# EAGLE design BaseBoard (EAGLE 8.5.0)
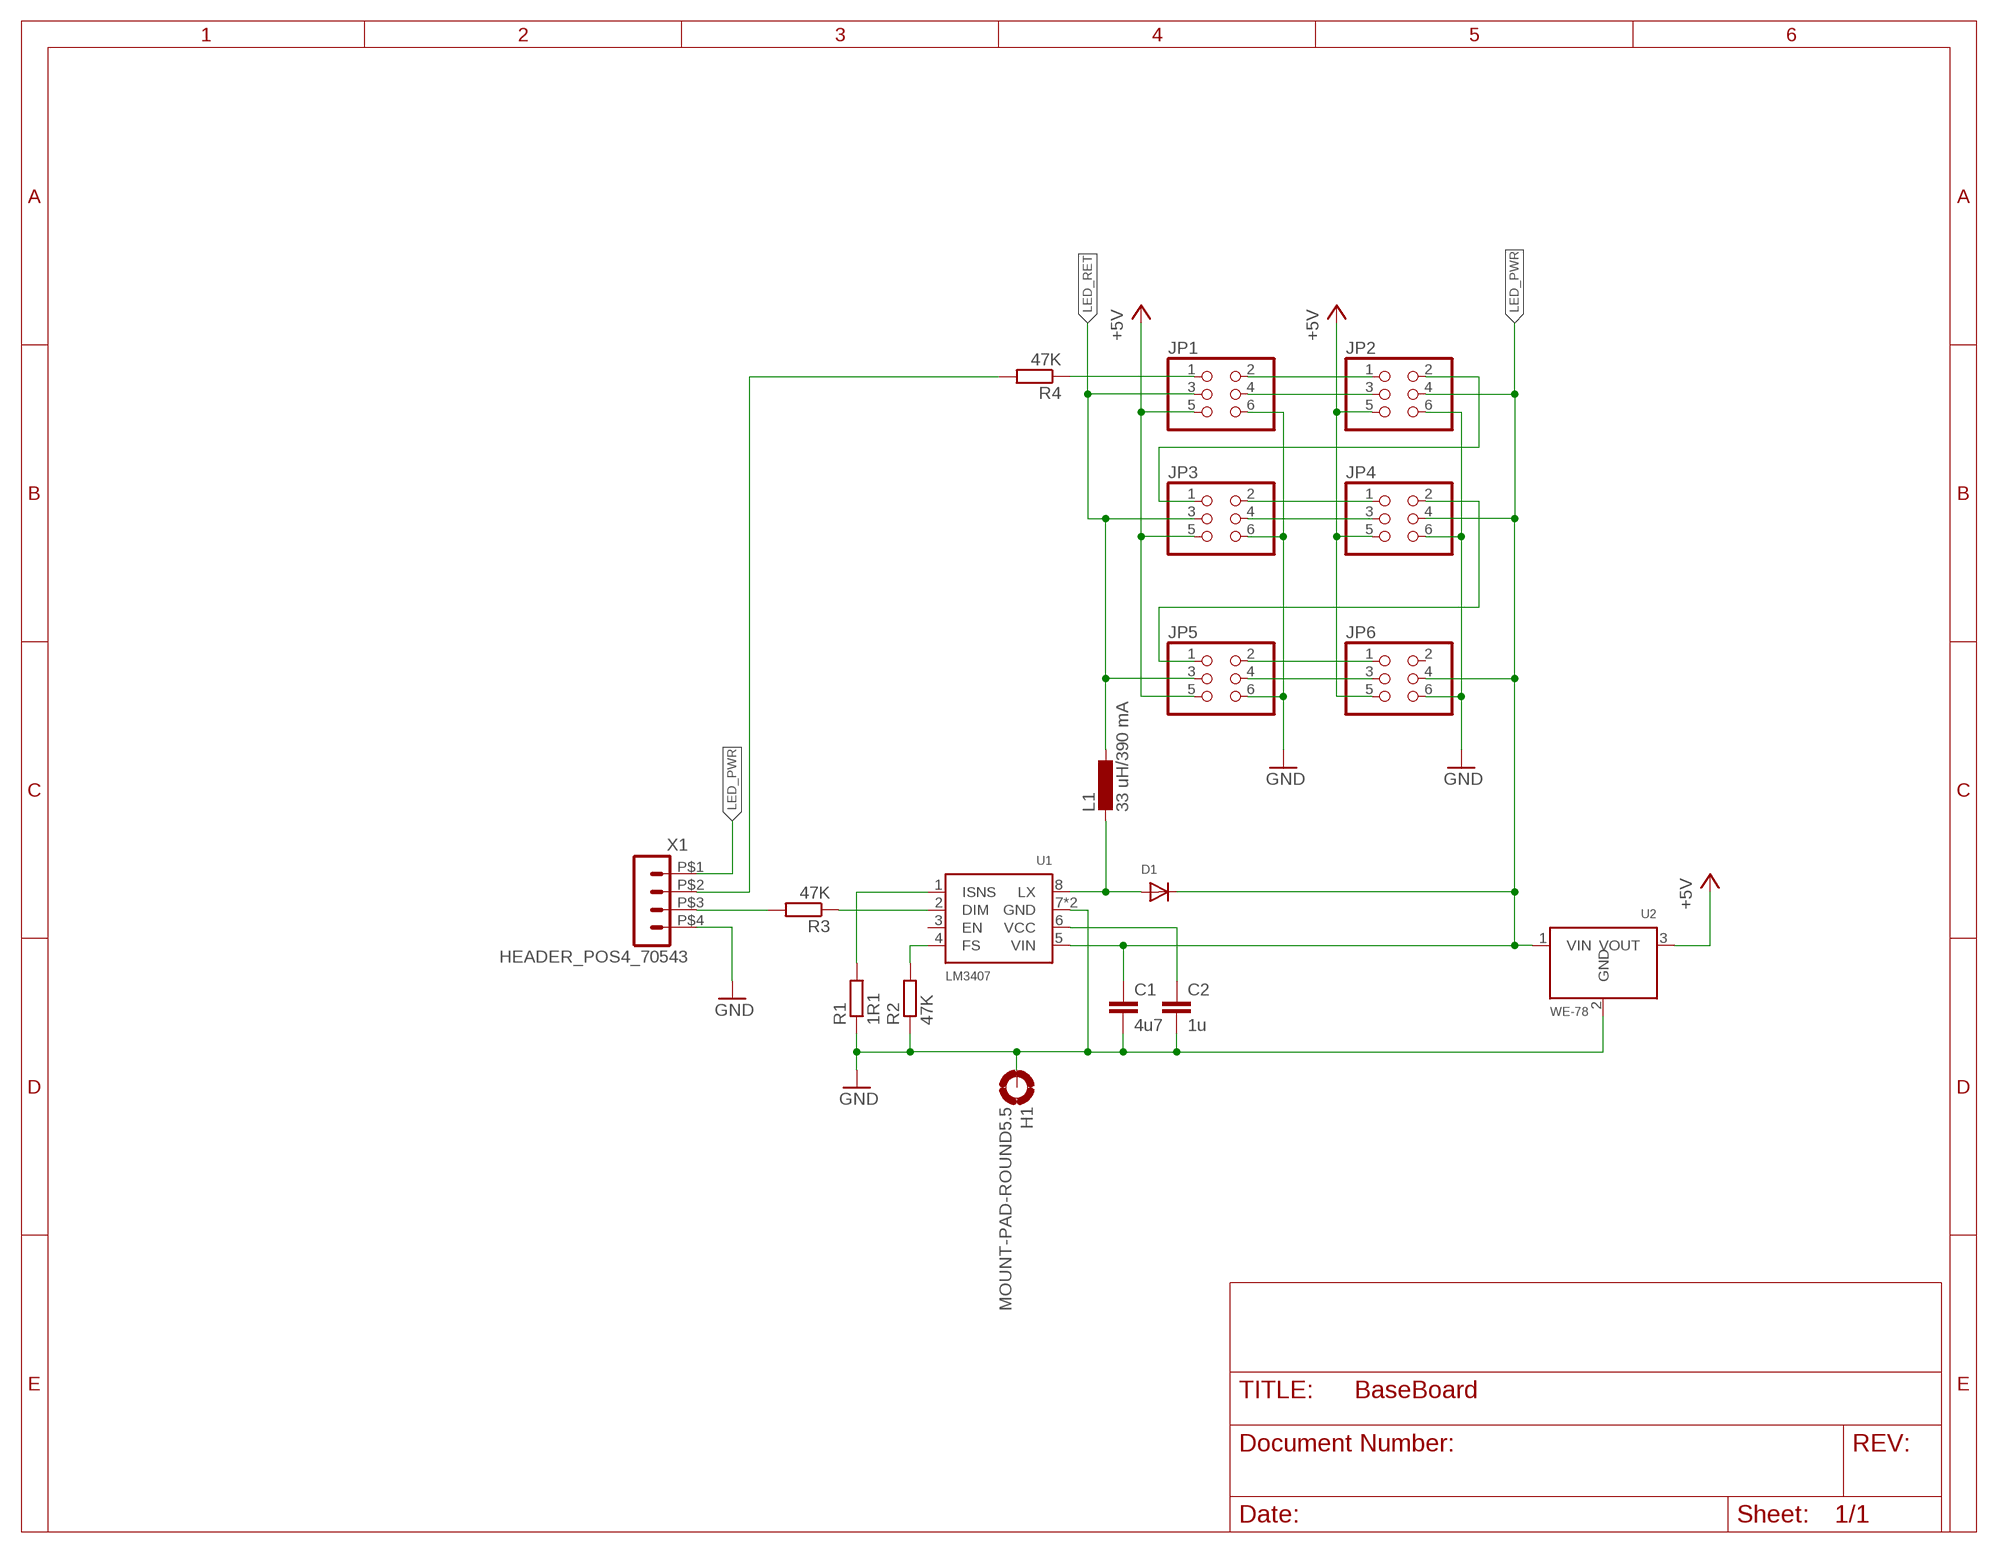
[diagram p0: schematic, sheet 1]

## Parts
C1  4u7  C-EUC1206  [C1206]
C2  1u  C-EUC0603  [C0603]
D1  DIODESOD-123  [SOD-123]
H1  MOUNT-PAD-ROUND5.5  [5,5-PAD]
JP1  PINHD-2X3  [2X03]
JP2  PINHD-2X3  [2X03]
JP3  PINHD-2X3  [2X03]
JP4  PINHD-2X3  [2X03]
JP5  PINHD-2X3  [2X03]
JP6  PINHD-2X3  [2X03]
L1  33 uH/390 mA  INDUCTOR-LQH32N  [C1210]
R1  1R1  R-EU_R1206  [R1206]
R2  47K  R-EU_R0603  [R0603]
R3  47K  R-EU_R0603  [R0603]
R4  47K  R-EU_R0603  [R0603]
U1  LM3407  [MSOP8-GND]
U2  WE-78  [WE-78]
X1  HEADER_POS4_70543  [70543-POS4]

## Nets
+5V: JP1.5 JP2.5 JP3.5 JP4.5 JP5.5 JP6.5 U2.3(VOUT)
GND: C1.2 C2.2 H1.B5,5(MOUNT) JP1.6 JP2.6 JP3.6 JP4.6 JP5.6 JP6.6 R1.1 R2.1 U1.7(GND) U1.THERM(GND) U2.2(GND) X1.P$4
LED_PWR: C1.1 D1.C JP2.4 JP4.4 JP6.4 U1.5(VIN) U2.1(VIN) X1.P$1
LED_RET: JP1.3 JP3.3 JP5.3 L1.1
N$1: R1.2 U1.1(ISNS)
N$2: R2.2 U1.4(FS)
N$3: R3.1 U1.2(DIM)
N$4: D1.A L1.2 U1.8(LX)
N$5: JP1.4 JP2.3
N$6: C2.1 U1.6(VCC)
N$7: JP3.4 JP4.3
N$8: JP5.4 JP6.3
N$9: JP1.2 JP2.1
N$10: JP2.2 JP3.1
N$11: JP4.2 JP5.1
N$12: JP5.2 JP6.1
N$13: JP3.2 JP4.1
N$14: R3.2 X1.P$3
N$15: R4.2 X1.P$2
N$19: JP1.1 R4.1
Unconnected: JP6.2 U1.3(EN)

## Library data of the parts
C1 C2 = resistor:C-EU: CAPACITOR, European symbol
D1 = adafruit:DIODE: Diode SMADIODE - SMA Surface Mount Package 20V 1A Schottky Diode Digikey: 641-1014-6-ND DO-1N4148 - Through Hole Small Current Diode SOD-123 20V 1 A (.5mV Vf) Schottky Diode - Digikey: MBRX120TPMSCT-ND SOD-323 10V 570mA (.38mV Vf, 3ns) Schottky Diode - Digikey: ZLLS410CT-ND SOD-523 30V 30mA Schottky Diode (RB751S-40TE61) - Digikey: RB751S-40TE61CT-ND SOT23-R/W - SOT23 Package (R = Solder Paste/Reflow Ovens, W = Hand-Soldering) BAT54Film 40V 300mA - Digikey: 497-7162-1-ND
H1 = holes:MOUNT-PAD-ROUND: MOUNTING PAD, round
JP1-JP6 = pinhead:PINHD-2X3: PIN HEADER
L1 = PowerComponents:INDUCTOR
R1-R4 = resistor:R-EU_: RESISTOR, European symbol
U1 = PowerComponents:LM3407
U2 = PowerComponents:WE-78
X1 = con-molex-c-grid-sl:HEADER_POS4_?: Molex -C-Grid® / SL Series connector Wire-to-Board 2.54 mm (0.100") pitch header, 4 positions.

## Board
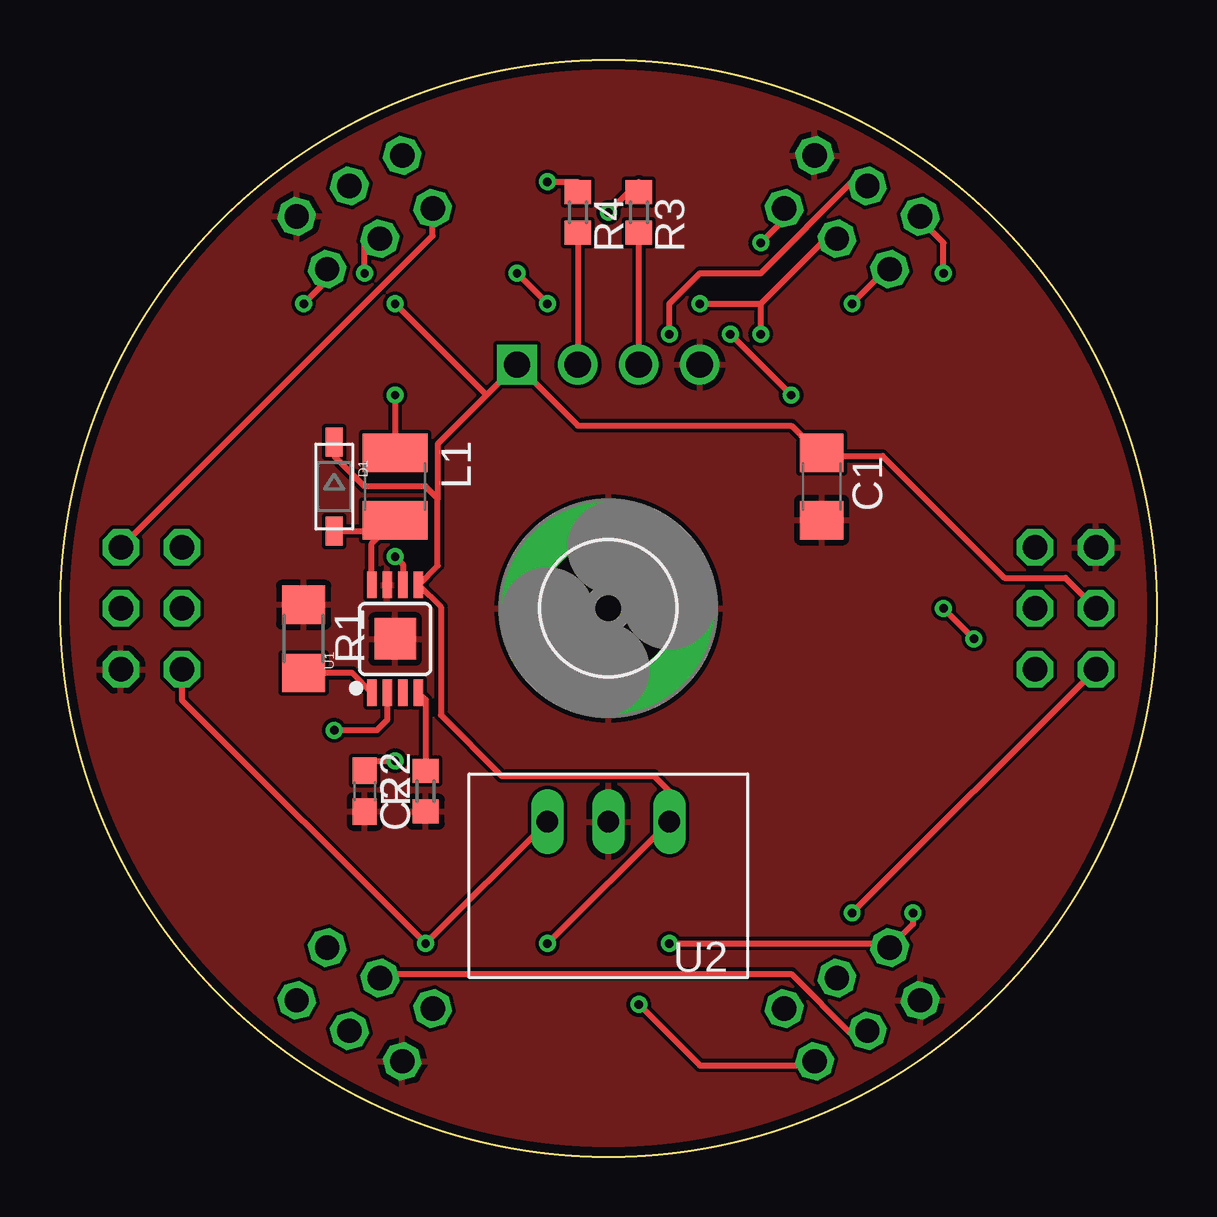
[diagram p1: board, top side]
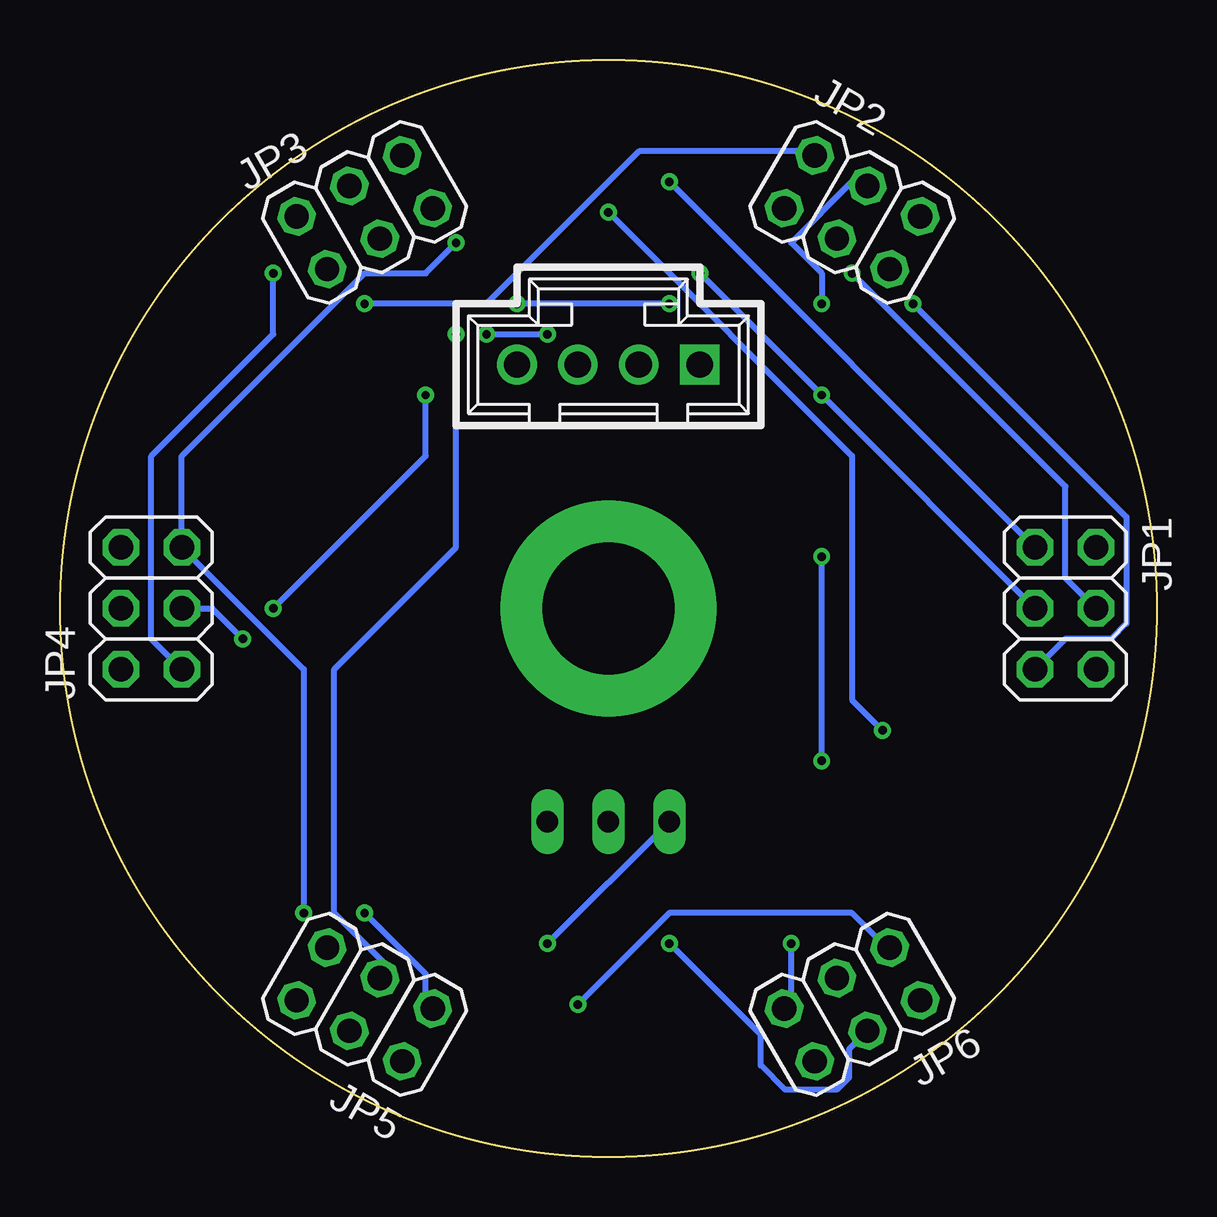
[diagram p2: board, bottom side, seen from below]

Size 45.72 x 45.72 mm. Coordinates in mm from the lower left corner, seen from the top.
Outline: circle at 22.86,22.86 radius 22.86
Copper layers (1*16): Top 0.0356mm / dielectric 1.5011mm / Bottom 0.0356mm
Design rules "LaenPCBOrder": minimum track width 6mil, minimum drill 13mil, track to track 6mil, track to pad 6mil, pad to pad 6mil, via to via 6mil, smd to smd 6mil, copper to edge 15mil, drill to drill 6mil, minimum pad ring 7mil, minimum via ring 7mil, stop-mask expansion 4mil, vias tented up to drill 0mil, thermal gap 10mil

### Footprints (pad centres in the part's own frame; a part is rotated, then mirrored left to right if it is on the bottom)
C1206 = smd 1.6 x 1.8: 1 -1.4,0; 2 1.4,0
C0603 = smd 1.1 x 1: 1 -0.85,0; 2 0.85,0
SOD-123 = smd 1.2 x 0.7: A 1.85,0; C -1.85,0
5,5-PAD = drill 5.5 pad 9: B5,5 0,0
2X03 = drill 1.016 octagon: 1 -2.54,-1.27; 2 -2.54,1.27; 3 0,-1.27; 4 0,1.27; 5 2.54,-1.27; 6 2.54,1.27
C1210 = smd 1.6 x 2.7: 1 -1.4,0; 2 1.4,0
R1206 = smd 1.6 x 1.803: 1 -1.422,0; 2 1.422,0
R0603 = smd 1 x 1.1: 1 -0.85,0; 2 0.85,0
MSOP8-GND = smd 0.4 x 1.1: 1 -0.975,-2.25; 2 -0.325,-2.25; 3 0.325,-2.25; 4 0.975,-2.25; 5 0.975,2.25; 6 0.325,2.25; 7 -0.325,2.25; 8 -0.975,2.25 | smd 1.727 x 1.727: THERM 0,0
WE-78 = drill 0.9 long: 1 -2.54,0; 2 0,0; 3 2.54,0
70543-POS4 = drill 1.1 square: P$1 3.81,0 | drill 1.1: P$2 1.27,0; P$3 -1.27,0; P$4 -3.81,0

### Placement (x,y rotation side)
C1  31.75,27.94 270 top
C2  12.7,15.24 270 top
D1  11.43,27.94 270 top
H1  22.86,22.86 0 top
JP1  3.81,22.86 270 bottom
JP2  12.7,39.37 330 bottom
JP3  33.02,39.37 30 bottom
JP4  41.91,22.86 90 bottom
JP5  33.02,6.35 150 bottom
JP6  12.7,6.35 210 bottom
L1  13.97,27.94 270 top
R1  10.16,21.59 270 top
R2  15.24,15.24 90 top
R3  24.13,39.37 270 top
R4  21.59,39.37 270 top
U1  13.97,21.59 0 top
U2  22.86,13.97 180 top
X1  22.86,33.02 0 bottom

### Tracks (layer width: path | path; a pad name or v marks a point on that pad's centre or on a via)
+5V  (via drill 0.35)
  Top 0.254: U2.3 v15.24,8.89 5.08,19.05 JP1.5 | v25.4,8.89 34.29,8.89 JP5.5 35.56,9.7 v35.56,10.16 | v10.16,35.56 11.43,36.83 JP2.5 | v29.21,38.1 30.48,39.37 JP3.5
  Bottom 0.254: v15.24,8.89 15.24,6.35 JP6.5 | U2.3 v25.4,8.89 | v35.56,10.16 35.56,20.32 JP4.5 40.64,29.21 33.02,36.83 30.48,36.83 v29.21,38.1 | v10.16,35.56 1.27,26.67 1.27,22.23 1.91,21.59 3.81,21.59 JP1.5
GND
  pour Top: 0,0 0,45.72 45.72,45.72 45.72,0
LED_PWR  (via drill 0.35)
  Top 0.254: D1.C 11.43,29.21 12.7,27.94 15.24,27.94 15.75,27.43 | 15.75,27.43 15.75,24.64 U1.5 15.88,22.91 15.88,18.41 18.41,15.88 24.77,15.88 25.4,15.24 U2.1 v20.32,8.89 | 17.78,31.75 X1.P$1 21.59,30.48 30.48,30.48 31.75,29.21 | 17.78,31.75 15.75,29.72 15.75,27.43 | JP4.4 41.91,24.13 39.37,24.13 34.29,29.21 31.75,29.21 | 31.75,29.21 C1.1 | v13.97,35.56 17.78,31.75
  Bottom 0.254: v20.32,8.89 16.51,5.08 16.51,3.81 15.49,2.79 13.34,2.79 12.83,3.3 12.83,4.49 JP6.4 | v13.97,35.56 13.97,36.83 15.24,38.1 12.7,40.64 JP2.4
LED_RET  (via drill 0.35)
  Top 0.254: v13.97,31.75 L1.1 13.97,29.21 | 29.21,35.56 31.75,38.1 JP3.3 | v26.67,35.56 29.21,35.56 | v19.05,36.83 v20.32,35.56 | v29.21,34.29 29.21,35.56
  Bottom 0.254: JP1.3 v13.97,31.75 v19.05,36.83 | v20.32,35.56 v26.67,35.56 | v29.21,34.29 29.21,25.4 34.29,20.32 34.29,10.16 31.75,7.62 JP5.3
N$1
  Top 0.254: U1.1 12.17,20.17 R1.2
N$2
  Top 0.254: U1.4 15.24,19.05 R2.2
N$3  (via drill 0.35)
  Top 0.254: v22.86,39.37 24.13,40.64 R3.1 | U1.2 13.64,18.22 13.21,17.78 v11.43,17.78
  Bottom 0.254: v11.43,17.78 12.7,19.05 12.7,29.21 v22.86,39.37
N$4
  Top 0.254: U1.8 12.99,25.57 L1.2 13.52,26.09 D1.A
N$5  (via drill 0.35)
  Top 0.254: v12.7,36.83 12.7,38.1 JP2.3
  Bottom 0.254: v12.7,36.83 3.81,27.94 3.81,24.13 JP1.4
N$6  (via drill 0.35)
  Top 0.254: C2.1 13.12,16.51 v13.97,16.51 | v13.97,25.02 14.29,24.69 U1.6
  Bottom 0.254: v13.97,16.51 v13.97,25.02
N$7  (via drill 0.35)
  Top 0.254: v25.4,34.29 25.4,35.56 26.67,36.83 29.21,36.83 33.02,40.64 JP3.4 | v30.48,31.75 v27.94,34.29 | v38.1,21.59 v36.83,22.86
  Bottom 0.254: v27.94,34.29 v25.4,34.29 | v30.48,31.75 30.48,29.21 v36.83,22.86 | v38.1,21.59 39.37,22.86 JP4.3
N$8
  Top 0.254: JP5.4 33.02,5.08 30.48,7.62 13.97,7.62 JP6.3
N$9
  Top 0.254: JP1.2 15.54,38.4 JP2.1
N$10  (via drill 0.35)
  Top 0.254: v33.02,35.56 34.29,36.83 JP3.1
  Bottom 0.254: v33.02,35.56 27.94,35.56 21.59,41.91 13.97,41.91 JP2.2
N$11  (via drill 0.35)
  Top 0.254: v33.02,10.16 JP4.2
  Bottom 0.254: v33.02,10.16 30.48,7.62 30.48,6.35 JP5.1
N$12  (via drill 0.35)
  Top 0.254: v24.13,6.35 26.67,3.81 31.75,3.81 JP5.2
  Bottom 0.254: v24.13,6.35 20.32,10.16 12.7,10.16 11.43,8.89 JP6.1
N$13  (via drill 0.35)
  Top 0.254: v36.83,36.83 36.83,38.1 35.56,39.37 JP3.2
  Bottom 0.254: v36.83,36.83 36.83,34.29 41.91,29.21 41.91,21.59 JP4.1
N$14
  Top 0.254: X1.P$3 R3.2
N$15
  Top 0.254: R4.2 X1.P$2
N$19  (via drill 0.35)
  Top 0.254: v20.32,40.64 21.59,40.64 R4.1
  Bottom 0.254: JP1.1 v20.32,40.64